# EAGLE design shematic (EAGLE 9.4.2)
ESKD_DATE1: 51|49|46|49|50|46|50|48|49|48; ESKD_DESCRIPTION1: 207|235|224|242|224|32|238|242|235|224|228|238|247|237|224|255|32|80|105|99|49|54|102|54|57|48; ESKD_DESCRIPTION2: 241|245|229|236|224|32|253|235|229|234|242|240|232|247|229|241|234|224|255; ESKD_DESCRIPTION3: 239|240|232|237|246|232|239|232|224|235|252|237|224|255; ESKD_ENGINEER: 207|238|234|240|238|226|241|234|232|233; ESKD_NUMBER: 192|193|194|195|32|49|50|51|48|48|48|46|48|48|49|32|221|51; ESKD_NUMBER_SHEET: 49; ESKD_SHEETS: 49
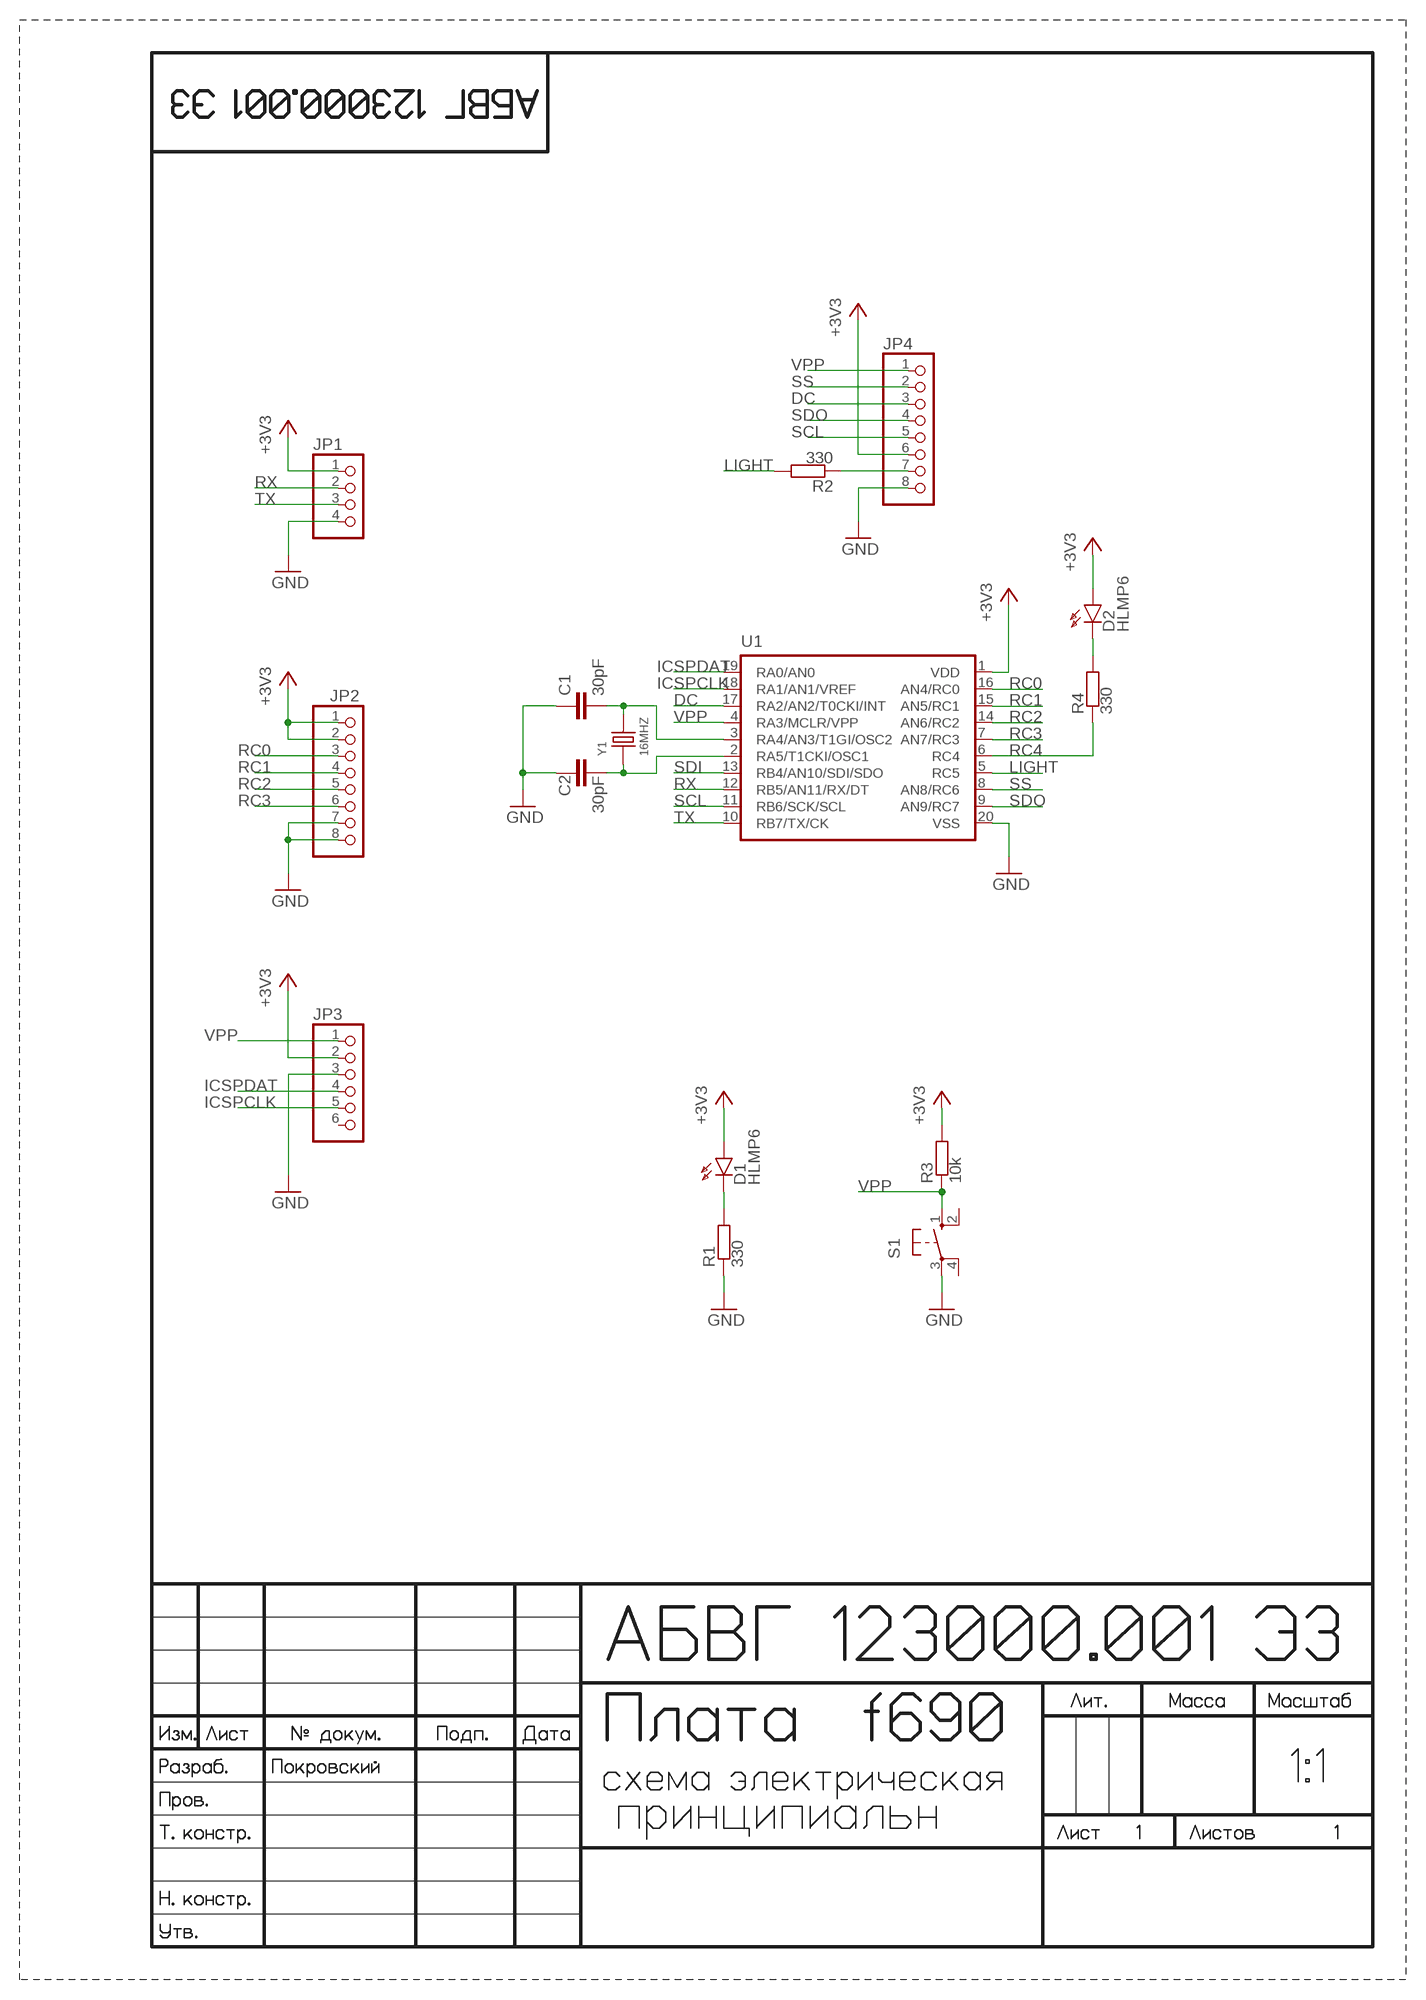
[diagram p0: schematic, sheet 1]

## Parts
C1  30pF  C5/2.5  [C5B2.5]
C2  30pF  C5/2.5  [C5B2.5]
D1  HLMP6  [HLMP6]
D2  HLMP6  [HLMP6]
JP1  PINHD-1X4/90  [1X04/90]
JP2  PINHD-1X8  [1X08]
JP3  PINHD-1X6/90  [1X06/90]
JP4  PINHD-1X8  [1X08]
R1  330  R-EU_R0805  [R0805]
R2  330  R-EU_R0805  [R0805]
R3  10k  R-EU_0204/7  [0204/7]
R4  330  R-EU_R0805  [R0805]
S1  10-XX  [B3F-10XX]
U1  PIC16F6XX  [DIL20]
Y1  16MHZ  DIP-CRYSTAL-16MHZ-18PF-30PPM-40R(HC49US)  [HC49US]

## Nets
+3V3 [+3V3]: D1.A D2.A JP1.1 JP2.1 JP2.2 JP3.2 JP4.6 R3.2 U1.1(VDD)
DC: JP4.3 U1.17(RA2/AN2/T0CKI/INT)
GND [GND]: C1.1 C2.1 JP1.4 JP2.7 JP2.8 JP3.3 JP4.8 R1.1 S1.3(P) U1.20(VSS)
ICSPCLK: JP3.5 U1.18(RA1/AN1/VREF)
ICSPDAT: JP3.4 U1.19(RA0/AN0)
LIGHT: R2.2 U1.5(RC5)
N$1: C1.2 U1.3(RA4/AN3/T1GI/OSC2) Y1.2
N$2: C2.2 U1.2(RA5/T1CKI/OSC1) Y1.1
N$3: D1.K R1.2
N$4: D2.K R4.2
N$5: JP4.7 R2.1
RC0: JP2.3 U1.16(AN4/RC0)
RC1: JP2.4 U1.15(AN5/RC1)
RC2: JP2.5 U1.14(AN6/RC2)
RC3: JP2.6 U1.7(AN7/RC3)
RC4: R4.1 U1.6(RC4)
RX: JP1.2 U1.12(RB5/AN11/RX/DT)
SCL: JP4.5 U1.11(RB6/SCK/SCL)
SDI: U1.13(RB4/AN10/SDI/SDO)
SDO: JP4.4 U1.9(AN9/RC7)
SS: JP4.2 U1.8(AN8/RC6)
TX: JP1.3 U1.10(RB7/TX/CK)
VPP: JP3.1 JP4.1 R3.1 S1.1(S) U1.4(RA3/MCLR/VPP)
Unconnected: JP3.6 S1.2(S1) S1.4(P1)

## Library data of the parts
C1 C2 = capacitor-wima:C: CAPACITOR naming: grid - package width
D1 D2 = display-hp:HLMP6: LED 2mm horizontal; MF: AGILENT TECHNOLOGIES; MPN: HLMP-6500; OC_FARNELL: 1652490; OC_NEWARK: 40K0088
JP1 = pinhead:PINHD-1X4: PIN HEADER
JP2 JP4 = pinhead:PINHD-1X8: PIN HEADER
JP3 = pinhead:PINHD-1X6: PIN HEADER
R1-R4 = rcl:R-EU_: RESISTOR, European symbol; SPICEPREFIX: R
S1 = switch-omron:10-XX: OMRON SWITCH; MPN: B3F-1000; OC_FARNELL: 176432; OC_NEWARK: 36M3542
U1 = pic16f690:PIC16F6XX
Y1 = OPL_Crystal Oscillator:DIP-CRYSTAL-16MHZ-18PF-30PPM-40R(HC49US): 306010014; MPN: HC-49US 16.000MHz

## Net classes
0 default: width 0.254 mm, clearance 0.025 mm
1 GND: width 0.61 mm, drill 0.406 mm, clearance 0.025 mm
2 +3V3: width 0.305 mm, drill 0.406 mm, clearance 0.025 mm

## Board
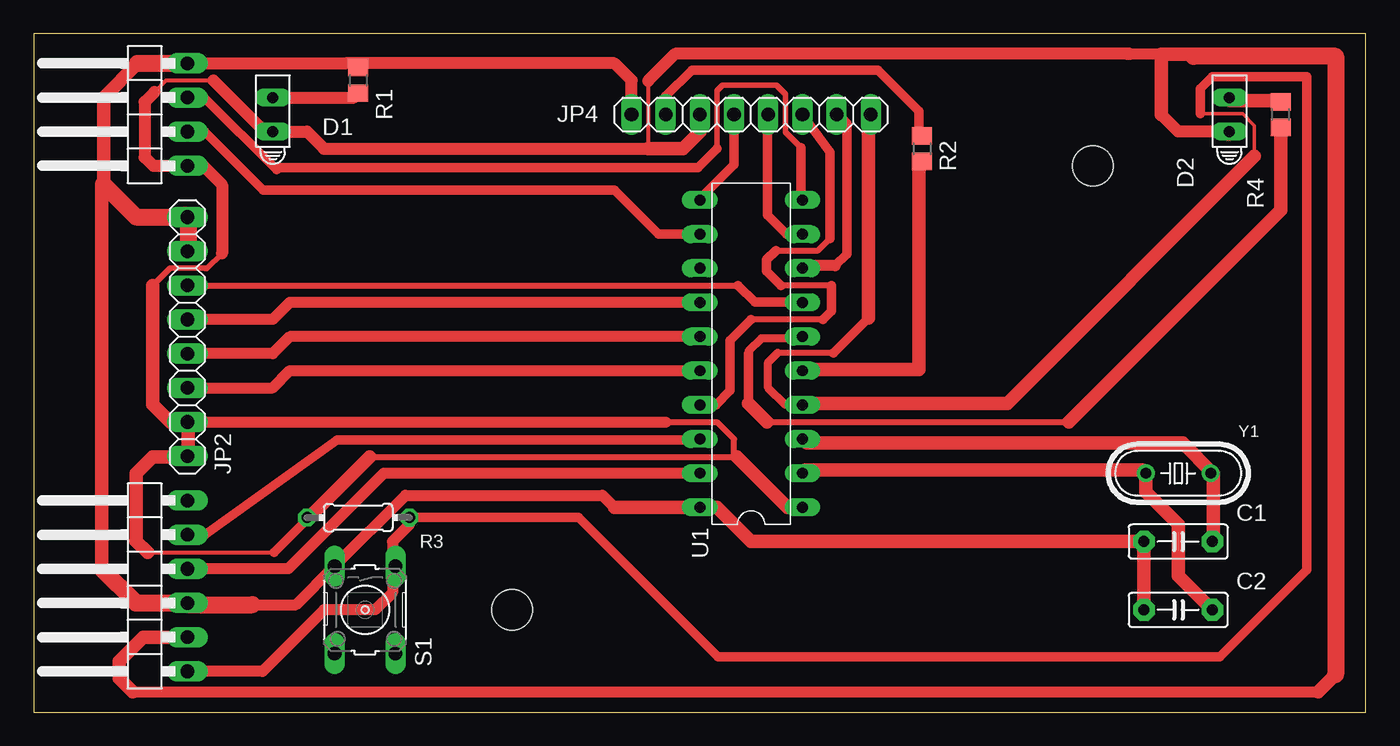
[diagram p1: board, top side]

Size 99.04 x 50.47 mm. Coordinates in mm from the lower left corner, seen from the top.
Outline: 0,0 99.04,0 99.04,50.47 0,50.47 0,0
Copper layers (1*16): Top 0.035mm / dielectric 1.5mm / Bottom 0.035mm
Design rules "default *": minimum track width 6mil, minimum drill 0.35mm, track to track 12mil, track to pad 12mil, pad to pad 12mil, via to via 12mil, smd to smd 8mil, copper to edge 40mil, drill to drill 6mil, minimum pad ring 10mil, minimum via ring 8mil, stop-mask expansion 4mil, vias tented up to drill 0mil, thermal gap 10mil
Holes 3 mm at 78.74,40.64 35.56,7.62

### Footprints (pad centres in the part's own frame; a part is rotated, then mirrored left to right if it is on the bottom)
C5B2.5 = drill 0.813 pad 1.6 octagon: 1 -2.54,0; 2 2.54,0
HLMP6 = drill 0.813 long: A -1.27,0; K 1.27,0
1X04/90 = drill 1.016 long: 1 -3.81,-3.81; 2 -1.27,-3.81; 3 1.27,-3.81; 4 3.81,-3.81
1X08 = drill 1.016 long: 1 -8.89,0; 2 -6.35,0; 3 -3.81,0; 4 -1.27,0; 5 1.27,0; 6 3.81,0; 7 6.35,0; 8 8.89,0
1X06/90 = drill 1.016 long: 1 -6.35,-3.81; 2 -3.81,-3.81; 3 -1.27,-3.81; 4 1.27,-3.81; 5 3.81,-3.81; 6 6.35,-3.81
R0805 = smd 1.3 x 1.5: 1 -0.95,0; 2 0.95,0
0204/7 = drill 0.813 octagon: 1 -3.81,0; 2 3.81,0
B3F-10XX = drill 1.016 long: 1 -3.251,2.261; 2 3.251,2.261; 3 -3.251,-2.261; 4 3.251,-2.261
DIL20 = drill 0.813 long: 1 -11.43,-3.81; 2 -8.89,-3.81; 3 -6.35,-3.81; 4 -3.81,-3.81; 5 -1.27,-3.81; 6 1.27,-3.81; 7 3.81,-3.81; 8 6.35,-3.81; 9 8.89,-3.81; 10 11.43,-3.81; 11 11.43,3.81; 12 8.89,3.81; 13 6.35,3.81; 14 3.81,3.81; 15 1.27,3.81; 16 -1.27,3.81; 17 -3.81,3.81; 18 -6.35,3.81; 19 -8.89,3.81; 20 -11.43,3.81
HC49US = drill 0.813: 1 -2.413,0; 2 2.413,0

### Placement (x,y rotation side)
C1  85.09,12.7 0 top
C2  85.09,7.62 0 top
D1  17.78,44.45 90 top
D2  88.9,44.45 90 top
JP1  7.62,44.45 90 top
JP2  11.43,27.94 90 top
JP3  7.62,9.4 90 top
JP4  53.34,44.45 180 top
R1  24.13,46.99 270 top
R2  66.04,41.91 270 top
R3  24.13,14.48 180 top
R4  92.71,44.45 90 top
S1  24.64,7.62 270 top
U1  53.34,26.67 90 top
Y1  85.09,17.78 0 top

### Tracks (layer width: path | path; a pad name or v marks a point on that pad's centre or on a via)
+3V3
  Top 0.305: 8.47,11.88 17.87,11.88 | 20.27,14.28 R3.2 20.52,14.53 | 11.25,19 JP2.1 11.5,19.25 | 11.5,21.5 JP2.2 | 13.37,47 9.87,47 8.99,46.12 | 11.25,40.75 JP1.1 | 45.68,46.95 45.68,41.91
  Top 0.4: 12.88,33 14.01,34.13
  Top 0.406: 12.88,33 12.74,33 12.72,33.02 10.14,33.02 8.87,31.74 8.87,31.73
  Top 0.45: 24.97,18.98 52.07,18.98 | 52.07,18.98 52.29,18.98 | 52.07,18.98 52.07,20.32 50.8,21.59 46.99,21.59
  Top 0.61: 83.82,48.96 83.82,48.95
  Top 0.7: 17.87,11.88 20.27,14.28 | JP1.1 12.6,40.64 | JP2.2 10.16,21.59
  Top 0.813: 7.37,1.52 95.5,1.52 | 7.62,12.78 7.59,12.76 | JP2.2 46.99,21.59 | 81.28,48.96 83.82,48.96
  Top 0.9: 13.37,47 17.18,43.18 D1.A 20.32,43.18 21.59,41.91 45.68,41.91 | 14.01,34.13 14.01,39.23 12.6,40.64 | 8.99,46.12 8.26,45.39 8.26,41.27 8.89,40.64 JP1.1 | D2.A 85.09,43.18 83.82,44.45 | 45.68,46.95 47.69,48.96 81.28,48.96 81.52,48.96
  Top 1: 7.59,12.76 8.47,11.88 | 11.25,19 8.87,19 7.62,17.75 7.62,12.78 | U1.1 56.03,15.24 52.29,18.98 | 20.52,14.53 24.97,18.98 | 11.5,19.25 11.5,21.5 | 45.68,41.91 48.26,41.91 49.53,43.18 JP4.6 | 95.5,1.52 96.79,2.81 | 8.87,31.73 8.87,22.89 10.16,21.59 | JP3.2 8.13,5.59 6.35,3.81 6.35,2.54 7.37,1.52 | 86.23,48.77 86.05,48.95 83.82,48.95 83.82,44.45
  Top 1.27: D2.A 88.83,43.12 | 96.79,2.81 96.79,48.77 86.23,48.77
DC
  Top 0.45: 58.69,29.23 53.34,29.23 | 59.32,31.73 55.55,31.73 | 59.19,35.23 58.31,34.35 55.18,34.35
  Top 0.7: U1.17 50.71,22.86 51.77,23.92 51.77,27.66 53.34,29.23 | 58.69,29.23 59.32,29.85 59.32,31.73 | 59.19,35.23 59.19,41.64 JP4.3 | 55.18,34.35 54.48,33.66 54.48,32.8 55.55,31.73
GND
  Top 0.61: 11.5,8.01 JP3.3 | 11.5,34.5 JP2.7 11.25,34.25 | 11.5,36.75 JP2.8 11.25,37 | 11.5,48.25 JP1.4 | 24,48 24.06,47.94 R1.1 23.81,48.26
  Top 0.813: 16.25,8.01 19.51,8.01 S1.3 27.64,16.13 42.29,16.13 43.18,15.24
  Top 0.9: JP1.4 23.18,48.26 23.81,48.26 43.18,48.26 44.45,46.99 JP4.8
  Top 1: 5.08,31.71 5.08,10.67 | C2.1 C1.1 53.34,12.7 50.8,15.24 U1.20 43.18,15.24 | 5.19,39.26 5.19,45.72 7.73,48.26
  Top 1.016: 5.19,39.26 5.08,39.14 5.08,31.71
  Top 1.27: 11.5,8.01 16.25,8.01 | 11.5,36.75 11.5,34.5 | 7.73,48.26 JP1.4 | 5.08,10.67 7.62,8.13 JP3.3 | 5.19,39.26 7.62,36.83 11.08,36.83 11.25,37
ICSPCLK
  Top 0.254: 12.7,13.21 JP3.5
  Top 0.7: U1.18 49.45,20.24 22.55,20.24 12.7,13.21
ICSPDAT
  Top 0.813: U1.19 26.04,17.78 18.92,10.67 JP3.4
LIGHT
  Top 0.254: 65.81,40.73 R2.2 | 57.31,25.48 U1.5
  Top 1: 65.81,40.73 65.81,25.48 57.31,25.48
N$1
  Top 0.254: 57.31,20.23 U1.3 | 87.68,17.78 Y1.2 87.69,17.77 | 87.69,12.79 C1.2
  Top 0.7: 57.5,20.04 57.31,20.23
  Top 1: 57.5,20.04 85.42,20.04 87.68,17.78 | 87.69,17.77 87.69,12.79
N$2
  Top 0.7: Y1.1 82.44,18.02 | U1.2 57.39,18.02
  Top 1: 82.44,18.02 57.39,18.02 | Y1.1 82.68,16.38 85.09,13.97 85.09,10.16 C2.2
N$3
  Top 0.9: D1.K 23.81,45.72 R1.2
N$4
  Top 0.254: 92.5,45.5 R4.2 | 89,45.5 D2.K
  Top 1: 89,45.5 92.5,45.5
N$5
  Top 0.254: 65.8,43.03 R2.1
  Top 0.7: 65.8,43.03 65.8,44.72 62.76,47.75 48.93,47.75 46.99,45.81 JP4.7
RC0
  Top 0.813: JP2.3 17.78,24.13 19.05,25.4 U1.16
RC1
  Top 0.813: U1.15 19.05,27.94 17.78,26.67 JP2.4
RC2
  Top 0.813: JP2.5 17.78,29.21 19.05,30.48 U1.14
RC3
  Top 0.45: JP2.6 52.38,31.75
  Top 0.7: 52.38,31.75 53.63,30.5 57.13,30.5 U1.7
RC4
  Top 0.45: 54.54,21.6 76.95,21.6
  Top 0.61: U1.6 57.02,27.81 54.1,27.81 53.16,26.87 53.16,26.67
  Top 0.7: 53.16,26.67 53.16,22.98
  Top 1: R4.1 92.71,37.36 76.95,21.6 | 53.16,22.98 54.54,21.6
RX
  Top 0.254: JP1.2 12.72,43.18
  Top 0.7: 12.72,43.18 17.06,38.83 43.18,38.83 46.45,35.56 U1.12
SCL
  Top 0.254: 49.56,38.23 U1.11 | 52.06,44.23 JP4.5
  Top 0.7: 49.56,38.23 52.06,40.73 52.06,44.23
SDO
  Top 0.254: JP4.4 54.56,44.4
  Top 0.7: U1.9 55.96,35.56 54.56,36.96 54.56,44.4
SS
  Top 0.254: 57.3,33.22 U1.8
  Top 0.7: 59.58,33.22 60.45,34.09 60.45,43.69
  Top 0.813: 59.58,33.22 57.3,33.22 | JP4.2 60.45,43.69
TX
  Top 0.254: JP1.3 12.68,45.72 | 57.06,38.23 U1.10 | 18.3,40.51 18.05,40.35
  Top 0.4: 50.8,41.91 50.8,46.23 51.22,46.64 55.21,46.64 55.88,45.97 55.88,43.16 57.06,41.98
  Top 0.7: 57.06,41.98 57.06,38.23 | 18.05,40.35 12.68,45.72 | 18.3,40.51 49.4,40.51 50.8,41.91
VPP
  Top 0.254: 62.06,44.23 JP4.1 | 86.74,44.5 89.87,44.5 90.75,43.63 90.75,41.36 90.76,41.36 | 57.31,22.98 U1.4
  Top 0.45: 59.45,26.73 55.31,26.73
  Top 0.61: U1.4 55.88,22.86 54.61,24.13 54.61,26.03 55.31,26.73
  Top 0.7: 62.06,29.33 59.45,26.73 | R3.1 40.52,14.48 50.86,4.13 88.19,4.13 94.64,10.59 94.64,47.26 87.62,47.26 86.74,46.38 86.74,44.5
  Top 0.813: R3.1 27.94,13.97 26.67,12.7 26.67,11.1 S1.1 26.67,10.64 26.67,8.89 25.4,7.62 21.59,7.62 17.02,3.05 JP3.1
  Top 1: 62.06,44.23 62.06,29.33 | 90.76,41.36 72.38,22.98 57.31,22.98